# EAGLE design Sapflux-Basic_AltD (EAGLE 9.6.2)
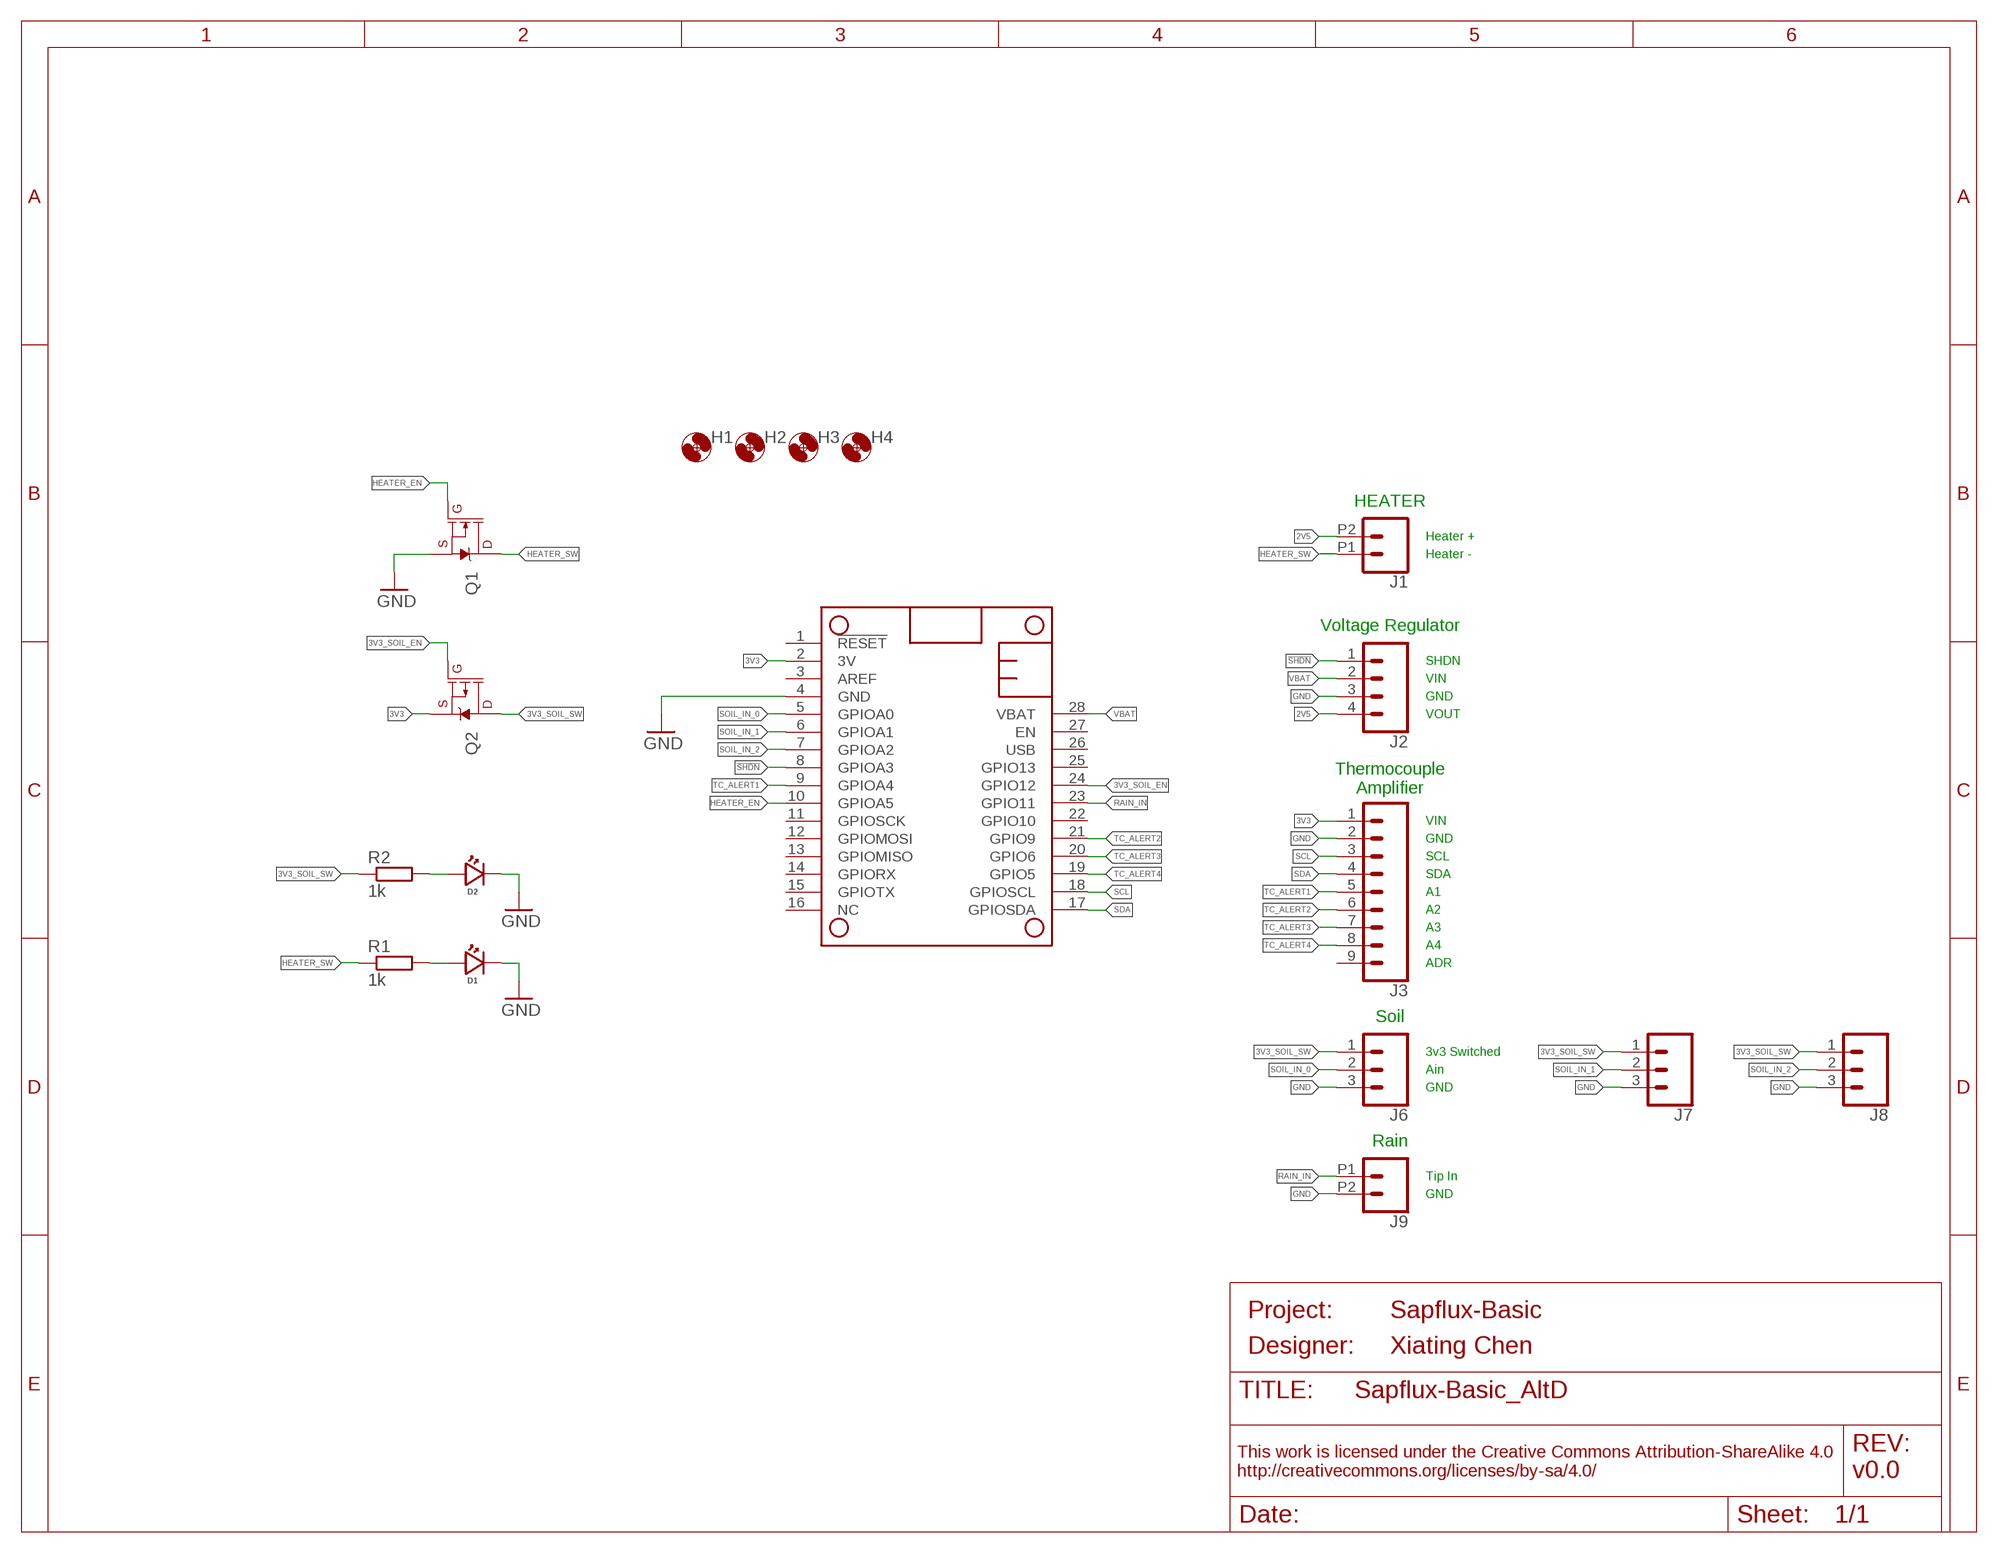
[diagram p0: schematic, sheet 1]
FRAME1 (FRAME_A_L): DESIGNER: Xiating Chen; PROJECT: Sapflux-Basic; REV: v0.0

## Parts
D1  LED3MM  [LED_3MM]
D2  LED3MM  [LED_3MM]
H1  MOUNTING_HOLE4_NP  [4_40]
H2  MOUNTING_HOLE4_NP  [4_40]
H3  MOUNTING_HOLE4_NP  [4_40]
H4  MOUNTING_HOLE4_NP  [4_40]
J1  CONN_2  CONN_022.54_SCREW_ROUND  [1X02_2.54_SCREWTERM_ROUND]
J2  CONN_42.54  [1X04]
J3  CONN_9  [1X09]
J6  CONN_32.54_SCREW  [1X03_SCREW]
J7  CONN_32.54_SCREW  [1X03_SCREW]
J8  CONN_32.54_SCREW  [1X03_SCREW]
J9  CONN_022.54_SCREW_ROUND  [1X02_2.54_SCREWTERM_ROUND]
MS1  FEATHERWINGLAYOUT  [FEATHERWING_MIN]
Q1  60V/32A/35mΩ  MOSFET-NCH-FQP30N06L  [TO220V]
Q2  24A/20V/50mΩ  MOSFET_PCH-NDP6020P  [TO220V]
R1  1k  R-EU_0204/7  [0204/7]
R2  1k  R-EU_0204/7  [0204/7]

## Nets
2V5: J1.P2 J2.4
3V3: J3.1 MS1.2(3V) Q2.3(S)
3V3_SOIL_EN: MS1.24(GPIO12) Q2.1(G)
3V3_SOIL_SW: J6.1 J7.1 J8.1 Q2.2(D) R2.1
!SHDN: J2.1 MS1.8(GPIOA3)
GND: D1.2(CATHODE) D2.2(CATHODE) J2.3 J3.2 J6.3 J7.3 J8.3 J9.P2 MS1.4(GND) Q1.3(S)
HEATER_EN: MS1.10(GPIOA5) Q1.1(G)
HEATER_SW: J1.P1 Q1.2(D) R1.1
N$1: D2.1(ANODE) R2.2
N$2: D1.1(ANODE) R1.2
RAIN_IN: J9.P1 MS1.23(GPIO11)
SCL: J3.3 MS1.18(GPIOSCL)
SDA: J3.4 MS1.17(GPIOSDA)
SOIL_IN_0: J6.2 MS1.5(GPIOA0)
SOIL_IN_1: J7.2 MS1.6(GPIOA1)
SOIL_IN_2: J8.2 MS1.7(GPIOA2)
TC_ALERT1: J3.5 MS1.9(GPIOA4)
TC_ALERT2: J3.6 MS1.21(GPIO9)
TC_ALERT3: J3.7 MS1.20(GPIO6)
TC_ALERT4: J3.8 MS1.19(GPIO5)
VBAT: J2.2 MS1.28(VBAT)
Unconnected: J3.9 MS1.1(!RESET) MS1.3(AREF) MS1.11(GPIOSCK) MS1.12(GPIOMOSI) MS1.13(GPIOMISO) MS1.14(GPIORX) MS1.15(GPIOTX) MS1.16(NC) MS1.22(GPIO10) MS1.25(GPIO13) MS1.26(USB) MS1.27(EN)

## Notes on the sheet
- HEATER
- Heater +
- Heater -
- Voltage Regulator
- SHDN
- VIN
- GND
- VOUT
- Thermocouple
  Amplifier
- VIN
- GND
- SCL
- SDA
- A1
- A2
- A3
- A4
- ADR
- Soil
- 3v3 Switched
- Ain
- GND
- Rain
- Tip In
- GND

## Library data of the parts
D1 D2 = bschulz:LED: Genaric LED
H1-H4 = bschulz:MOUNTING_HOLE: Genaric Mechanical Mounting Hole Hole diameter based on max body diameter + 15% Keepout ring is for diameter of socket cap screw (minimum required clearance) TPlace ring is for diameter of pan head screw (recomended clearance) Specifications: Socket Cap <http://fastener-express.com/fastener-technical/SocketscapSS-Alloy.pdf> Button Head Socket Cap <http://fastener-express.com/fastener-technical/Button-Socket-alloy.pdf> Pan Head <http://fastener-express.com/fastener-technical/pan-machine-Screws.pdf>; DIGIKEY: DNP; MF: N/A; MPN: DNP
J1 J9 = bschulz:CONN_02: Genaric 2 terminal header SCREW_2.54 <https://www.digikey.com/product-detail/en/on-shore-technology-inc/OSTVN02A150/ED10561-ND/1588862> 39532_RA <https://www.digikey.com/product-detail/en/molex/0395321002/WM7845-ND/1280696>; DIGIKEY: ED10561-ND; MF: OnShore; MPN: OSTVN02A150
J2 = bschulz:CONN_4: Genaric 4 terminal header Digikey 2.54_SCREW <https://www.digikey.com/product-detail/en/on-shore-technology-inc/OSTVN04A150/ED10563-ND/1588864>; DIGIKEY: 2057-PH1-04-UA-ND; MF: Adam Tech; MPN: PH1-04-UA
J3 = bschulz:CONN_9: Genaric 9 terminal header Digikey 2.54_SCREW <https://www.digikey.com/en/products/detail/te-connectivity-amp-connectors/282834-9/1827298>; DIGIKEY: 2057-PH1-09-UA-ND; MF: Adam Tech; MPN: PH1-09-UA
J6-J8 = bschulz:CONN_3: Genaric 3 terminal header Digikey 2.54_SCREW <https://www.digikey.com/product-detail/en/on-shore-technology-inc/OSTVN03A150/ED10562-ND/1588863> 3.5_SCREW <https://www.digikey.com/product-detail/en/on-shore-technology-inc/OSTTE030161/ED2636-ND/614585> 5.08_PLUG <https://www.digikey.com/en/products/detail/phoenix-contact/1755749/260519>; DIGIKEY: ED10562-ND; MF: On Shore; MPN: OSTVN03A150
MS1 = bschulz:FEATHERWING
Q1 = SparkFun-DiscreteSemi:MOSFET-NCH: N-channel MOSFETs Voltage controlled devices that allow control of high current outputs. SparkFun Products: SparkFun OpenScale <https://www.sparkfun.com/products/13261> SparkFun Digital Sandbox <https://www.sparkfun.com/products/12651> SparkFun Monster Moto Shield <https://www.sparkfun.com/products/10182> SparkFun MOSFET Power Controller <https://www.sparkfun.com/products/11214>; DIGIKEY: IRLB8721PBF-ND; MF: Infineon; MPN: IRLB8721PBF; PROD_ID: TRANS-10060
Q2 = SparkFun-DiscreteSemi:MOSFET_PCH: P-channel MOSFETs Voltage controlled devices that allow control of high current outputs. SparkFun Products: SparkFun ESP32 Thing <https://www.sparkfun.com/products/13907> SparkFun ESP8266 Thing <https://www.sparkfun.com/products/13231> SparkFun Pi Servo HAT V2 <https://www.sparkfun.com/products/15316> DMG2305UX-7 (20V/4.2A/SOT23-3); DIGIKEY: SUP53P06-20-E3-ND; MF: Vishay; MPN: SUP53P06-20-E3
R1 R2 = bschulz_passives:R-EU_: RESISTOR, European symbol Digikey Parts: Yageo, 0402 <https://www.digikey.com/products/en/resistors/chip-resistor-surface-mount/52?k=&pkeyword=&sv=0&s=4356&sf=1&FV=-1%7C13%2C7%7C2%2C1291%7C39157%2C1989%7C0%2C-8%7C52%2C3%7C1131%2C3%7C2503&quantity=&ColumnSort=0&page=1&stock=1&pageSize=25> Yageo, 0603 <https://www.digikey.com/products/en/resistors/chip-resistor-surface-mount/52?k=&pkeyword=&sv=0&pv1291=39245&sf=1&FV=-5%7C4356%2C-5%7C47360%2C-8%7C52%2C-1%7C13%2C7%7C2%2C1989%7C0&quantity=10&ColumnSort=1000011&page=1&stock=1&pageSize=25> Panasonic, 0603 <https://www.digikey.com/products/en/resistors/chip-resistor-surface-mount/52?k=&pkeyword=&pv252=68&sf=0&FV=ffec373d%2C1c0002%2C142c040c%2C1f140000%2Cffe00034%2C80002%2Cc0001&quantity=&ColumnSort=0&page=1&stock=1&pageSize=25> Panasonic, precision, 0603 <https://www.digikey.com/products/en/resistors/chip-resistor-surface-mount/52?FV=ffec4907%2Cfffc000a%2Cc0172%2C142c040c%2C1f140000%2Cffe00034%2C1c0002&quantity=100&ColumnSort=2085&page=1&stock=1&pageSize=25> Panasonic, 0805 <https://www.digikey.com/products/en/resistors/chip-resistor-surface-mount/52?k=&pkeyword=&pv3=1&sf=0&FV=ffec373d%2C1c0002%2C1f140000%2Cffe00034%2C142c040d&quantity=&ColumnSort=0&page=1&stock=1&pageSize=25> Rohm, current sense <https://www.digikey.com/products/en/resistors/chip-resistor-surface-mount/52?k=&pkeyword=&pv3=1&sf=0&FV=ffecb688%2C1f140000%2Cffe00034%2C1c0002&quantity=&ColumnSort=0&page=1&stock=1&pageSize=25> Vishay, pulse proof automotive <https://www.digikey.com/products/en/resistors/chip-resistor-surface-mount/52?k=&pkeyword=&pv7=2&sf=0&FV=ffec5d6b%2Cffe00034%2C1f140000&quantity=&ColumnSort=0&page=1&stock=1&pageSize=25>

## Board
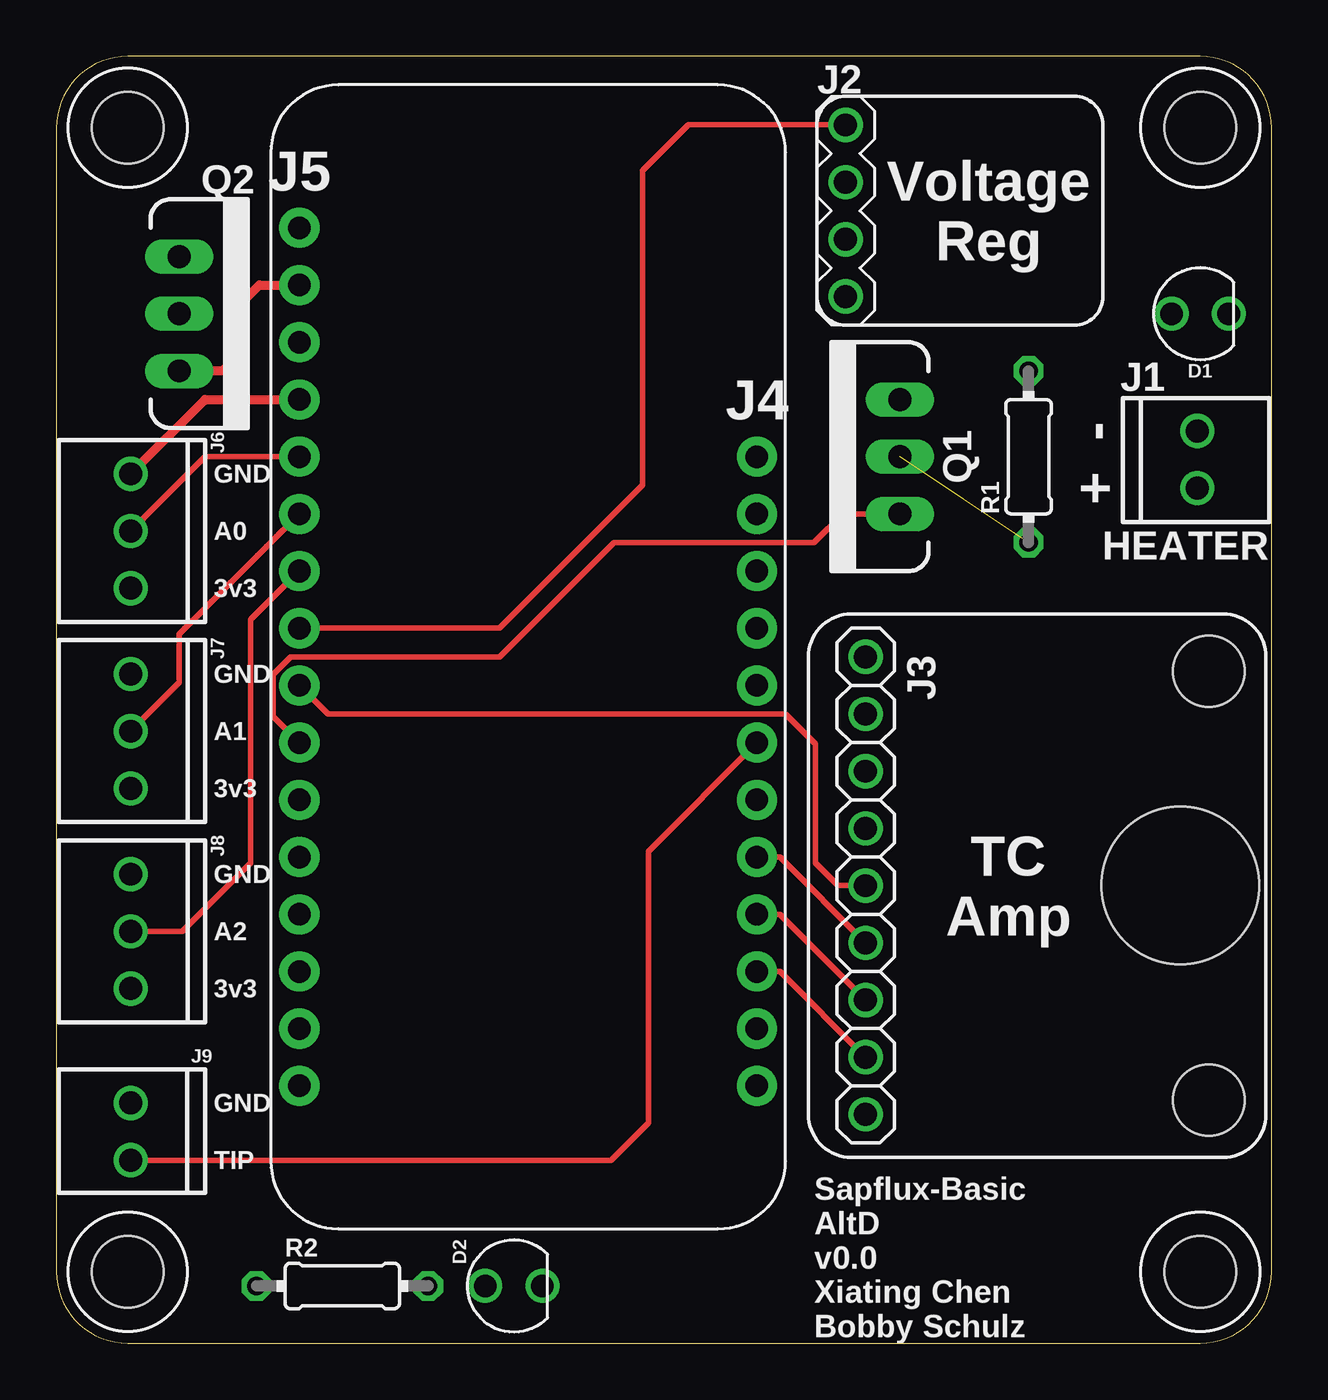
[diagram p1: board, top side]
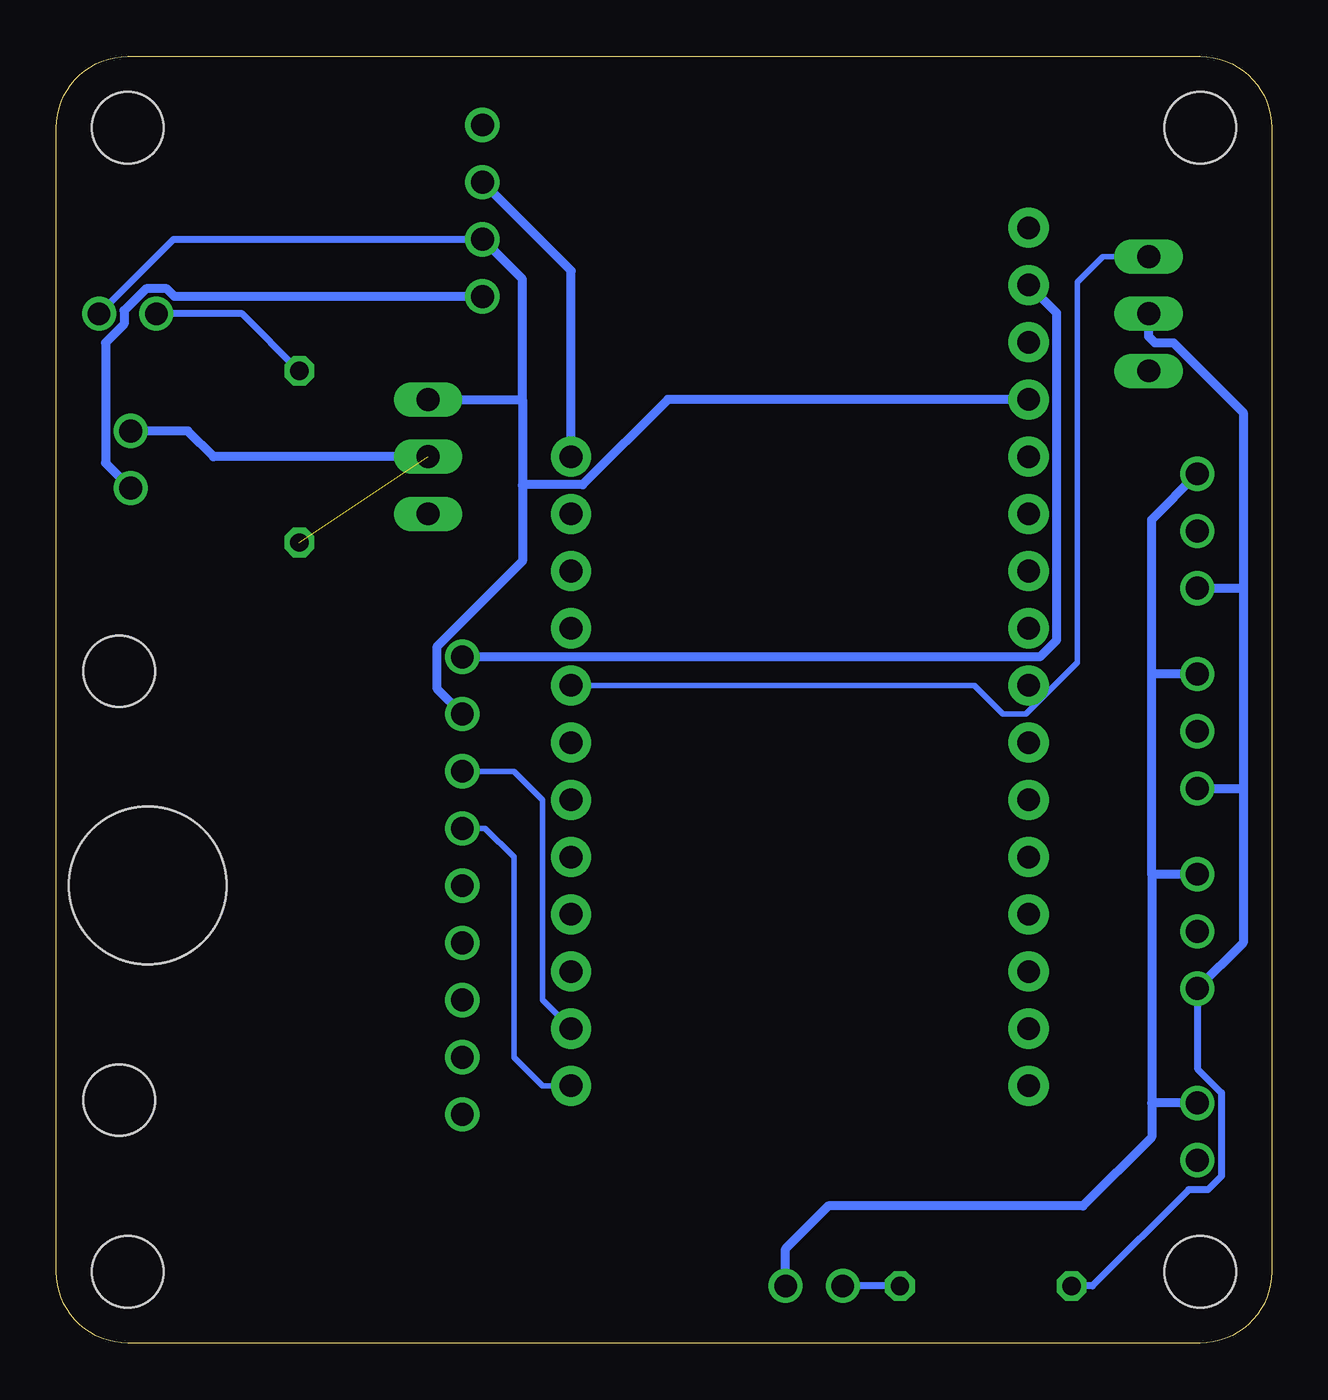
[diagram p2: board, bottom side, seen from below]

Size 53.98 x 57.15 mm. Coordinates in mm from the lower left corner, seen from the top.
Outline: 53.98,3.17 53.98,53.98 arc90 50.8,57.15 3.17,57.15 arc90 0,53.98 0,3.17 arc90 3.17,0 50.8,0 arc90 53.98,3.17
Copper layers (1*16): Top 0.035mm / dielectric 1.5mm / Bottom 0.035mm
Design rules "default": minimum track width 6mil, minimum drill 0.35mm, track to track 6mil, track to pad 6mil, pad to pad 6mil, via to via 6mil, smd to smd 6mil, copper to edge 40mil, drill to drill 6mil, minimum pad ring 10mil, minimum via ring 8mil, stop-mask expansion 4mil, vias tented up to drill 0mil, thermal gap 10mil
Holes 3.17 mm at 51.18,29.84 51.18,10.79
Holes 7 mm at 49.91,20.32

### Footprints (pad centres in the part's own frame; a part is rotated, then mirrored left to right if it is on the bottom)
LED_3MM = drill 1: 1 0,1.27; 2 0,-1.27
4_40 = hole 3.175: 0,0
1X02_2.54_SCREWTERM_ROUND = drill 1.016: P1 1.27,0; P2 -1.27,0
1X04 = drill 1.016: 1 -3.81,0; 2 -1.27,0; 3 1.27,0; 4 3.81,0
1X09 = drill 1.016: 1 -10.16,0; 2 -7.62,0; 3 -5.08,0; 4 -2.54,0; 5 0,0; 6 2.54,0; 7 5.08,0; 8 7.62,0; 9 10.16,0
1X03_SCREW = drill 1.016: 1 -2.54,0; 2 0,0; 3 2.54,0
FEATHERWING_MIN = drill 1 pad 1.778: 1 6.35,1.27; 2 8.89,1.27; 3 11.43,1.27; 4 13.97,1.27; 5 16.51,1.27; 6 19.05,1.27; 7 21.59,1.27; 8 24.13,1.27; 9 26.67,1.27; 10 29.21,1.27; 11 31.75,1.27; 12 34.29,1.27; 13 36.83,1.27; 14 39.37,1.27; 15 41.91,1.27; 16 44.45,1.27; 17 44.45,21.59; 18 41.91,21.59; 19 39.37,21.59; 20 36.83,21.59; 21 34.29,21.59; 22 31.75,21.59; 23 29.21,21.59; 24 26.67,21.59; 25 24.13,21.59; 26 21.59,21.59; 27 19.05,21.59; 28 16.51,21.59
TO220V = drill 1.016 long: 1 -2.54,0; 2 0,0; 3 2.54,0
0204/7 = drill 0.813 octagon: 1 -3.81,0; 2 3.81,0

### Placement (x,y rotation side)
D1  50.8,45.72 90 top
D2  20.32,2.54 90 top
H1  3.17,53.98 0 top
H2  3.17,3.17 0 top
H3  50.8,53.98 0 top
H4  50.8,3.17 0 top
J1  50.67,39.24 90 top
J2  35.05,50.29 270 top
J3  35.94,20.32 270 top
J6  3.3,36.07 90 top
J7  3.3,27.18 90 top
J8  3.3,18.29 90 top
J9  3.3,9.4 270 top
MS1  9.53,55.88 270 top
Q1  37.47,39.37 90 top
Q2  5.46,45.72 270 top
R1  43.18,39.37 90 top
R2  12.7,2.54 0 top

### Tracks (layer width: path | path; a pad name or v marks a point on that pad's centre or on a via)
2V5
  Bottom 0.406: J1.P2 51.79,39.09 51.79,44.43 50.96,45.26 50.96,45.86 49.99,46.83 49.07,46.83 48.72,46.48 J2.4
3V3
  Top 0.406: MS1.2 9.02,46.99 8.26,46.23 8.26,44.07 7.37,43.18 Q2.3
  Bottom 0.406: MS1.2 9.55,45.74 9.55,31.23 10.3,30.48 J3.1
3V3_SOIL_EN
  Bottom 0.254: MS1.24 13.21,29.21 11.94,27.94 10.92,27.94 8.64,30.23 8.64,47.12 7.49,48.26 Q2.1
3V3_SOIL_SW
  Bottom 0.305: J8.1 3.3,12.19 2.23,11.12 2.23,7.42 2.83,6.82 3.68,6.82 7.96,2.54 R2.1
  Bottom 0.406: Q2.2 5.46,44.7 5.18,44.42 4.36,44.42 1.27,41.33 1.27,33.53 | J8.1 1.27,17.78 1.27,24.64 | 1.27,33.53 1.27,24.64 | J7.1 1.27,24.64 | J6.1 1.27,33.53
!SHDN
  Top 0.254: MS1.8 19.68,31.75 26.04,38.1 26.04,52.07 28.07,54.1 J2.1
GND
  Top 0.406: J6.3 6.6,41.91 MS1.4
  Bottom 0.305: D1.2 48.77,49.02 J2.3
  Bottom 0.406: MS1.4 26.82,41.91 30.6,38.12 33.25,38.12 33.27,38.1 | 33.27,41.91 33.27,47.24 J2.3 | Q1.3 33.27,41.91 | 33.27,41.91 33.27,38.1 | 33.27,38.1 33.27,34.73 37.06,30.94 37.06,29.06 J3.2 | J6.3 5.33,36.58 5.33,29.72 | 5.33,20.83 5.33,29.72 | J7.3 5.33,29.72 | J8.3 5.33,20.83 | 5.33,20.83 5.33,10.67 | 5.33,10.67 5.33,9.14 8.38,6.1 19.68,6.1 21.59,4.19 D2.2 | J9.P2 5.33,10.67
HEATER_EN
  Top 0.254: Q1.1 34.92,36.83 33.66,35.56 24.77,35.56 19.68,30.48 10.41,30.48 9.63,29.69 9.63,27.84 MS1.10
HEATER_SW  (1 unrouted)
  Bottom 0.406: Q1.2 46.99,39.37 48.13,40.51 J1.P1
N$1
  Bottom 0.305: R2.2 D2.1
N$2
  Bottom 0.305: R1.2 45.72,45.72 D1.1
RAIN_IN
  Top 0.254: J9.P1 24.64,8.13 26.29,9.78 26.29,21.84 MS1.23
SCL
  Bottom 0.254: MS1.18 32.38,15.24 32.38,24.13 33.66,25.4 J3.3
SDA
  Bottom 0.254: MS1.17 32.38,11.43 33.66,12.7 33.66,21.59 34.92,22.86 J3.4
SOIL_IN_0
  Top 0.254: MS1.5 6.6,39.37 J6.2
SOIL_IN_1
  Top 0.254: J7.2 5.46,29.34 5.46,31.5 MS1.6
SOIL_IN_2
  Top 0.254: J8.2 5.59,18.29 8.64,21.34 8.64,32.13 MS1.7
TC_ALERT1
  Top 0.254: J3.5 34.72,20.32 33.71,21.34 33.71,26.62 32.38,27.94 12.06,27.94 MS1.9
TC_ALERT2
  Top 0.254: J3.6 32.13,21.59 MS1.21
TC_ALERT3
  Top 0.254: J3.7 32.13,19.05 MS1.20
TC_ALERT4
  Top 0.254: J3.8 32.13,16.51 MS1.19
VBAT
  Bottom 0.406: J2.2 31.11,47.62 MS1.28

### Text on the board
tPlace: J5 | Voltage / Reg | J4 | - | GND | + | A0 | HEATER | 3v3 | GND | A1 | 3v3 | GND | TC / Amp | A2 | 3v3 | GND | TIP | Sapflux-Basic / AltD / v0.0 / Xiating Chen / Bobby Schulz
tDocu: Heater / PWR | Soil | Rain | Soil / PWR